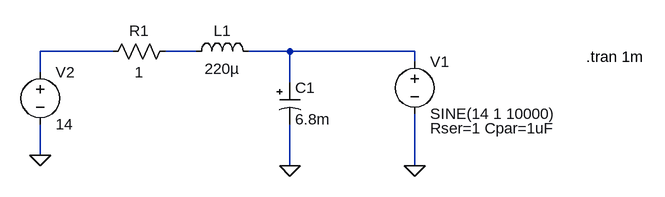
[diagram p0: schematic filter.asc]
filter.asc, the LTspice schematic file:
Version 4
SHEET 1 948 680
WIRE 96 240 -16 240
WIRE 224 240 176 240
WIRE 368 240 304 240
WIRE 560 240 368 240
WIRE 560 256 560 240
WIRE -16 272 -16 240
WIRE 368 288 368 240
WIRE -16 400 -16 352
WIRE 368 416 368 352
WIRE 560 416 560 336
FLAG -16 400 0
FLAG 368 416 0
FLAG 560 416 0
SYMBOL ind 208 256 R270
WINDOW 0 32 56 VTop 2
WINDOW 3 5 56 VBottom 2
SYMATTR InstName L1
SYMATTR Value 220µ
SYMATTR SpiceLine Ipk=5.2 Rser=68.8m Rpar=25.434K Cpar=0 mfg="   ---" pn="   ---"
SYMBOL polcap 352 288 R0
WINDOW 0 24 8 Left 2
WINDOW 3 24 56 Left 2
SYMATTR InstName C1
SYMATTR Value 6.8m
SYMATTR Description Capacitor
SYMATTR Type cap
SYMATTR SpiceLine Rser=30m Lser=0 mfg="Nichicon" pn="UPR1E682MRH" type="Al electrolytic"
SYMBOL voltage 560 240 R0
WINDOW 39 24 118 Left 2
SYMATTR InstName V1
SYMATTR Value SINE(14 1 10000)
SYMATTR SpiceLine Rser=1 Cpar=1uF
SYMBOL voltage -16 256 R0
SYMATTR InstName V2
SYMATTR Value 14
SYMATTR SpiceLine Rser=0
SYMBOL res 192 224 R90
WINDOW 0 0 56 VBottom 2
WINDOW 3 32 56 VTop 2
SYMATTR InstName R1
SYMATTR Value 1
TEXT 824 248 Left 2 !.tran 1m

The netlist it stands for:
* filter.asc
L1 N002 N003 220µ Ipk=5.2 Rser=68.8m Rpar=25.434K Cpar=0 mfg="   ---" pn="   ---"
C1 N003 0 6.8m Rser=30m Lser=0 mfg="Nichicon" pn="UPR1E682MRH" type="Al electrolytic"
V1 N003 0 SINE(14 1 10000) Rser=1 Cpar=1uF
V2 N001 0 14 Rser=0
R1 N002 N001 1
.tran 1m
.backanno
.end